# EasyEDA schematic SCH_JTAG 14P转10P_2022-09-26.json
TITLE: Sheet_1; REV: 1.0; Date: 2022-08-10; Sheet: 1/1; Drawn By: Denjhang; Company: Your Company
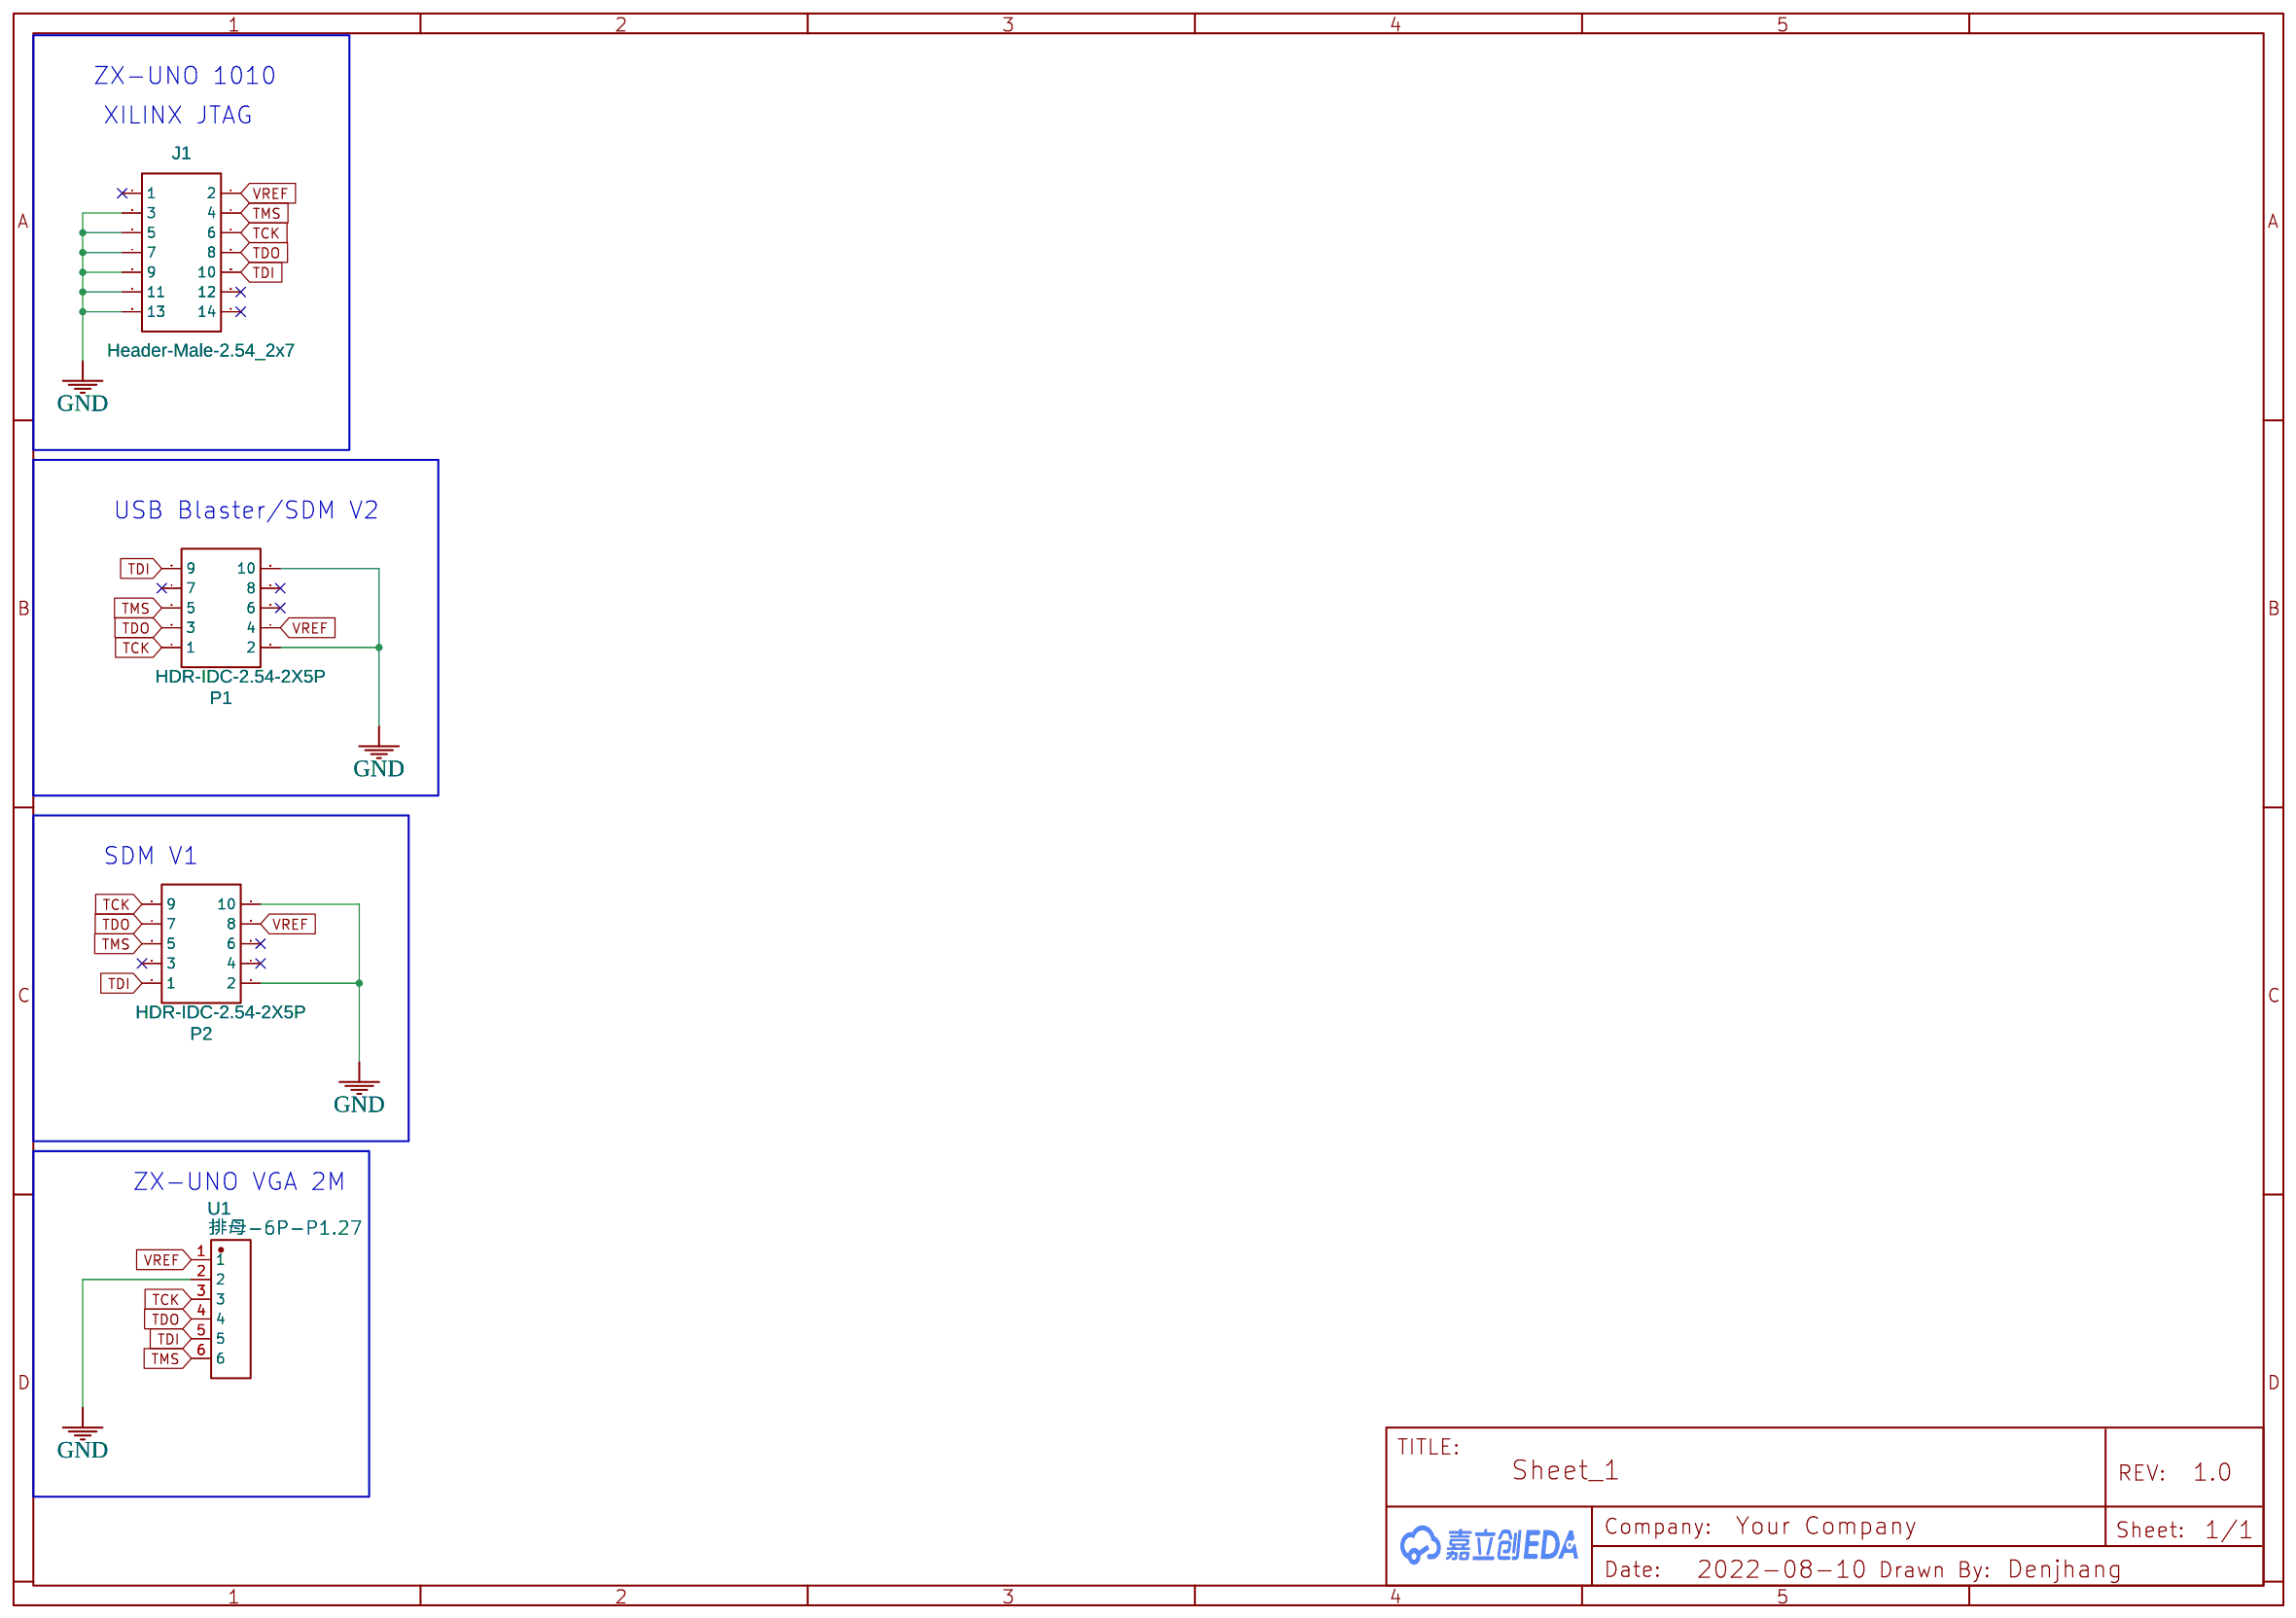
[diagram p0: schematic sheet]

## Parts
J1  Header-Male-2.54_2x7  [HDR-TH_14P-P2.54-V-M-R2-C7-S2.54]
P1  HDR-IDC-2.54-2X5P  [IDC-TH_10P-P2.54_C5665]
P2  HDR-IDC-2.54-2X5P  [IDC-TH_10P-P2.54_C5665]
U1  排母-6P-P1.27  [CONN-TH_6P-P1.27_KINGHELM_KH-1.27FH-1X6P-H4.3]

## Library data of the parts
J1 = Header-Male-2.54_2x7: Supplier: LCSC; Manufacturer: BOOMELE; Manufacturer Part: Double row of needle2X7P 2.54mm; Supplier Part: C71397; JLCPCB Part Class: Extended Part
P1 P2 = HDR-IDC-2.54-2X5P: Supplier: LCSC; Manufacturer: BOOMELE; Manufacturer Part: IDC Box 2.54mm 2X5P; Supplier Part: C5665; JLCPCB Part Class: Extended Part
U1 = 排母-6P-P1.27: Supplier: LCSC; Supplier Part: C2938382; Manufacturer: kinghelm(金航标); Manufacturer Part: KH-1.27FH-1X6P-H4.3; Contributor: LCSC; JLCPCB Part Class: Extended Part

## Nets
GND: J1.3 J1.5 J1.7 J1.9 J1.11 J1.13 P1.2 P1.10 P2.2 P2.10 U1.2
TCK: J1.6 P1.1 P2.9 U1.3
TDI: J1.10 P1.9 P2.1 U1.5
TDO: J1.8 P1.3 P2.7 U1.4
TMS: J1.4 P1.5 P2.5 U1.6
VREF: J1.2 P1.4 P2.8 U1.1

Not connected (* = marked no-connect by the designer): J1 1* 12* 14*; P1 6* 7* 8*; P2 3* 4* 6*

## Notes on the sheet
- ZX-UNO 1010
- XILINX JTAG
- USB Blaster/SDM V2
- SDM V1
- ZX-UNO VGA 2M
